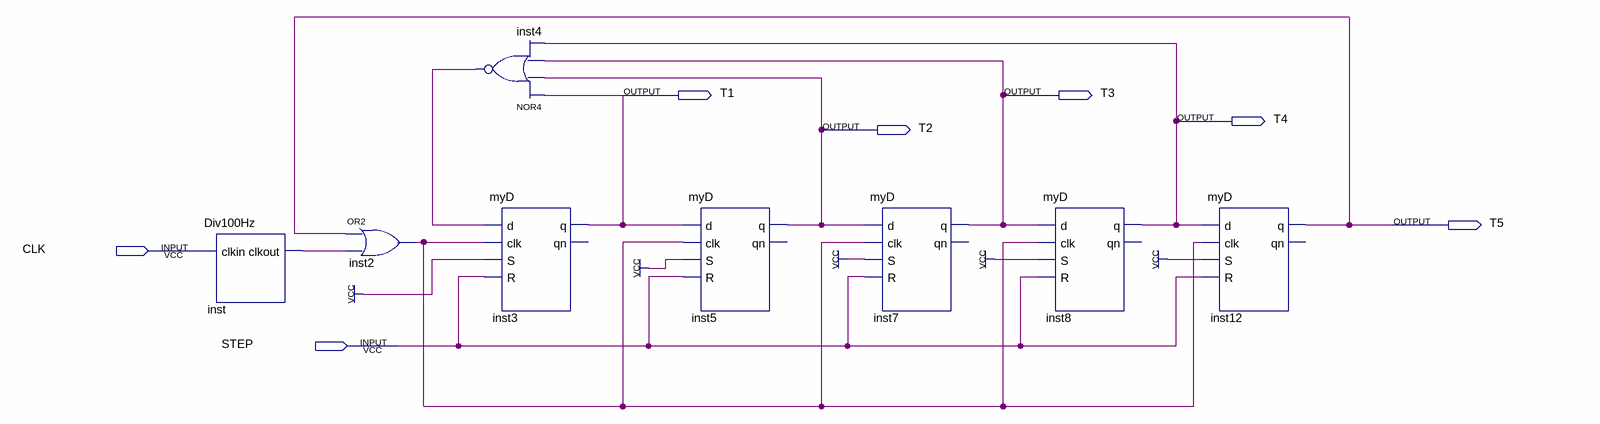
[diagram p0: schematic sheet]
// Quartus schematic exp2_3.bdf as structural Verilog: 8 symbols, 7 pins
module exp2_3 (
  input  CLK,
  input  STEP,
  output T1,
  output T3,
  output T4,
  output T2,
  output T5
);

  wire inst2_out, inst4_out, inst_clkout;

  Div100Hz inst (.clkin(CLK), .clkout(inst_clkout));
  or inst2 (inst2_out, T5, inst_clkout);
  nor inst4 (inst4_out, T1, T2, T3, T4);
  myD inst3 (.d(inst4_out), .clk(inst2_out), .S(1'b1), .R(STEP), .q(T1));  // open: qn
  myD inst5 (.d(T1), .clk(inst2_out), .S(1'b1), .R(STEP), .q(T2));  // open: qn
  myD inst7 (.d(T2), .clk(inst2_out), .S(1'b1), .R(STEP), .q(T3));  // open: qn
  myD inst8 (.d(T3), .clk(inst2_out), .S(1'b1), .R(STEP), .q(T4));  // open: qn
  myD inst12 (.d(T4), .clk(inst2_out), .S(1'b1), .R(STEP), .q(T5));  // open: qn
endmodule
